# EAGLE design espurna-h (EAGLE 8.3.2)
PROJECT_AUTHOR: tinkerman.cat <xose.perez@gmail.com>; PROJECT_LICENSE: CC-BY-SA 4.0; PROJECT_NAME: ESPURNA-H; PROJECT_VERSION: 0.8.20171028
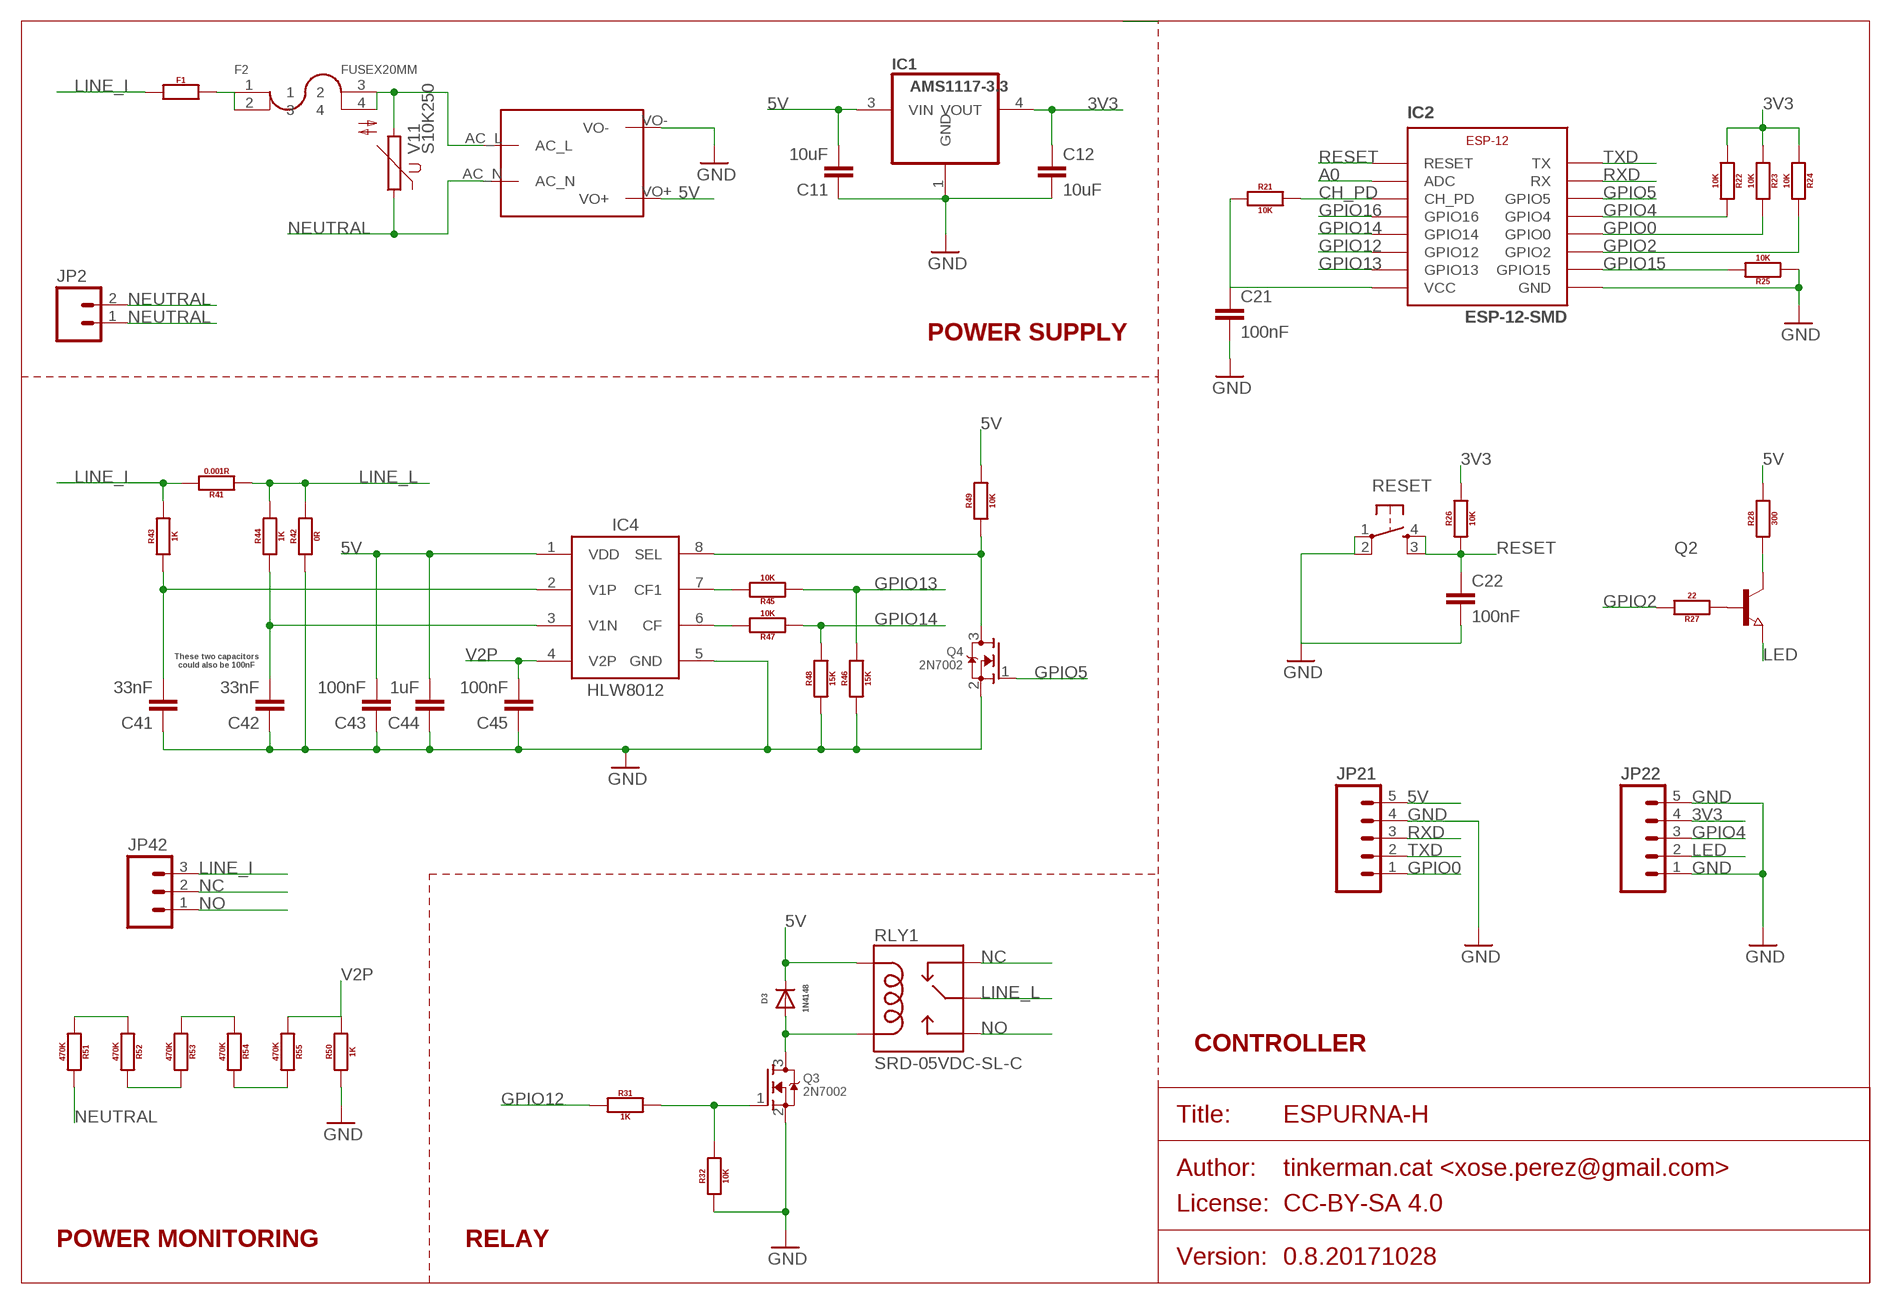
[diagram p0: schematic, sheet 1]

## Parts
C11  10uF  C-EU0805  [0805]
C12  10uF  C-EU0805  [0805]
C21  100nF  C-EU0805  [0805]
C22  100nF  C-EU0805  [0805]
C41  33nF  C-EU0805  [0805]
C42  33nF  C-EU0805  [0805]
C43  100nF  C-EU0805  [0805]
C44  1uF  C-EU0805  [0805]
C45  100nF  C-EU0805  [0805]
D3  1N4148  DIODE  [SOD80]
F1  THERMALFUSE0.4  [AXIAL-0.4]
F2  FUSEX20MM  [FUSE_5MM]
IC1  AMS1117-3.3  REG1117SOT223-2  [SOT223]
IC2  ESP-12-SMD  [ESP-12-SMD]
IC4  HLW8012  [SOP8]
JP2  M02200MIL  [SCREWTERMINAL-200MIL-2]
JP21  M05PTH  [1X05]
JP22  M05PTH  [1X05]
JP42  M03200MIL  [SCREWTERMINAL-200MIL-3]
Q2  NPN-TRANSISTOR_SOT23  [SOT23]
Q3  2N7002  MOSFET-NREFLOW  [SOT23]
Q4  2N7002  MOSFET-NREFLOW  [SOT23]
R21  10K  RESISTOR0805  [0805]
R22  10K  RESISTOR0805  [0805]
R23  10K  RESISTOR0805  [0805]
R24  10K  RESISTOR0805  [0805]
R25  10K  RESISTOR0805  [0805]
R26  10K  RESISTOR0805  [0805]
R27  22  RESISTOR0805  [0805]
R28  300  RESISTOR0805  [0805]
R31  1K  RESISTOR0805  [0805]
R32  10K  RESISTOR0805  [0805]
R41  0.001R  RESISTOR2512  [2512]
R42  0R  RESISTOR1206  [1206]
R43  1K  RESISTOR0805  [0805]
R44  1K  RESISTOR0805  [0805]
R45  10K  RESISTOR0805  [0805]
R46  15K  RESISTOR0805  [0805]
R47  10K  RESISTOR0805  [0805]
R48  15K  RESISTOR0805  [0805]
R49  10K  RESISTOR0805  [0805]
R50  1K  RESISTOR0805  [0805]
R51  470K  RESISTOR0805  [0805]
R52  470K  RESISTOR0805  [0805]
R53  470K  RESISTOR0805  [0805]
R54  470K  RESISTOR0805  [0805]
R55  470K  RESISTOR0805  [0805]
RESET  TACTILE_BUTTON_SMD  [TACTILE-BUTTON-SMD]
RLY1  SRD-05VDC-SL-C  RELAYSONGLE  [SRD-5VDC-SL-C]
U$1  MAINS_CONVERTERS  [HLK-PM01]
V11  S10K250  [S10K250]

## Nets
3V3: C12.1 C21.1 IC1.4(VOUT) IC2.VCC JP22.4 R21.1 R22.1 R23.1 R24.1 R26.2
5V: C11.2 C43.2 C44.2 D3.2(C) IC1.3(VIN) IC4.1(VDD) JP21.5 R28.2 R49.2 RLY1.COIL1 U$1.VO+
A0: IC2.ADC
CH_PD: IC2.CH_PD R21.2
GND: C11.1 C12.2 C21.2 C22.2 C41.1 C42.1 C43.1 C44.1 C45.1 IC1.1(GND) IC2.GND IC4.5(GND) JP21.4 JP22.1 JP22.5 Q3.2(S) Q4.2(S) R25.1 R32.1 R42.1 R46.1 R48.1 R50.1 RESET.1(SWA1) RESET.2(SWB1) U$1.VO-
GPIO0: IC2.GPIO0 JP21.1 R23.2
GPIO2: IC2.GPIO2 R24.2 R27.2
GPIO4: IC2.GPIO4 JP22.3 R22.2
GPIO5: IC2.GPIO5 Q4.1(G)
GPIO12: IC2.GPIO12 R31.1
GPIO13: IC2.GPIO13 R45.1 R46.2
GPIO14: IC2.GPIO14 R47.1 R48.2
GPIO15: IC2.GPIO15 R25.2
GPIO16: IC2.GPIO16
LED: JP22.2 Q2.2(E)
LINE_I: F1.P$1 JP42.3 R41.2 R43.2
LINE_L: R41.1 R42.2 R44.2 RLY1.COMMON(MAIN)
LINE_P: F2.3 F2.4 U$1.AC_L V11.2
N$1: Q2.3(C) R28.1
N$3: Q2.1(B) R27.1
N$4: D3.1(A) Q3.3(D) RLY1.COIL2
N$5: Q3.1(G) R31.2 R32.2
N$6: R51.1 R52.1
N$7: F1.P$2 F2.1 F2.2
N$8: R52.2 R53.2
N$10: IC4.8(SEL) Q4.3(D) R49.1
N$11: IC4.7(CF1) R45.2
N$12: C41.2 IC4.2(V1P) R43.1
N$13: IC4.6(CF) R47.2
N$14: C42.2 IC4.3(V1N) R44.1
N$15: R53.1 R54.1
N$16: R54.2 R55.2
NC: JP42.2 RLY1.CLOSED(NC)
NEUTRAL: JP2.1 JP2.2 R51.2 U$1.AC_N V11.1
NO: JP42.1 RLY1.OPEN(NO)
RESET: C22.1 IC2.RESET R26.1 RESET.3(SWB2) RESET.4(SWA2)
RXD: IC2.RX JP21.3
TXD: IC2.TX JP21.2
V2P: C45.2 IC4.4(V2P) R50.2 R55.1

## Notes on the sheet
- POWER SUPPLY
- These two capacitors
  could also be 100nF
- CONTROLLER
- POWER MONITORING | RELAY

## Library data of the parts
C11 C12 C21 C22 C41-C45 = xose:C-EU: CAPACITOR, European symbol
D3 = xose:DIODE
F1 = xose:THERMALFUSE
F2 = xose:FUSE
IC1 = xose:REG1117: 800mA and 1A Low Dropout (LDO) Positive Regulator 1.8V, 2.5V, 2.85V, 3.3V, 5V, and Adj
IC2 = xose:ESP-12
IC4 = xose:HLW8012
JP2 = xose:M02: Standard 2-pin 0.1" header. Use with - straight break away headers ( PRT-00116) - right angle break away headers (PRT-00553) - swiss pins (PRT-00743) - machine pins (PRT-00117) - female headers (PRT-00115) Molex polarized connector foot print use with: PRT-08233 with associated crimp pins and housings. 2.54_SCREWTERM for use with PRT-10571. 3.5mm Screw Terminal footprints for PRT-08084 5mm Screw Terminal footprints for use with PRT-08432
JP21 JP22 = xose:M05: Header 5 Standard 5-pin 0.1" header. Use with straight break away headers (SKU : PRT-00116), right angle break away headers (PRT-00553), swiss pins (PRT-00743), machine pins (PRT-00117), and female headers (PRT-00115). Molex polarized connector foot print use with SKU : PRT-08230 with associated crimp pins and housings.
JP42 = xose:M03: Header 3 Standard 3-pin 0.1" header. Use with straight break away headers (SKU : PRT-00116), right angle break away headers (PRT-00553), swiss pins (PRT-00743), machine pins (PRT-00117), and female headers (PRT-00115). Molex polarized connector foot print use with SKU : PRT-08232 with associated crimp pins and housings.
Q2 = xose:NPN-TRANSISTOR_: NPN TRANSISTOR
Q3 Q4 = xose:MOSFET-N: N-Channel Mosfet 2N7002E - 60V 260mA SOT23 [Digikey: 2N7002ET1GOSTR-ND] - REEL BSH103 - 30V 850mA SOT23 [Digikey: 568-5013-1-ND]
R21-R28 R31 R32 R41-R55 = xose:RESISTOR: Generic EU resistor symbol
RESET = xose:TACTILE_BUTTON: Tactile Button SparkFun Electronics' Tactile Button COM-10302
RLY1 = Spark:RELAY: SPDT relay (COM-00101)
U$1 = captain-slow:MAINS_CONVERTERS
V11 = xose:S10K250: VARISTOR

## Board
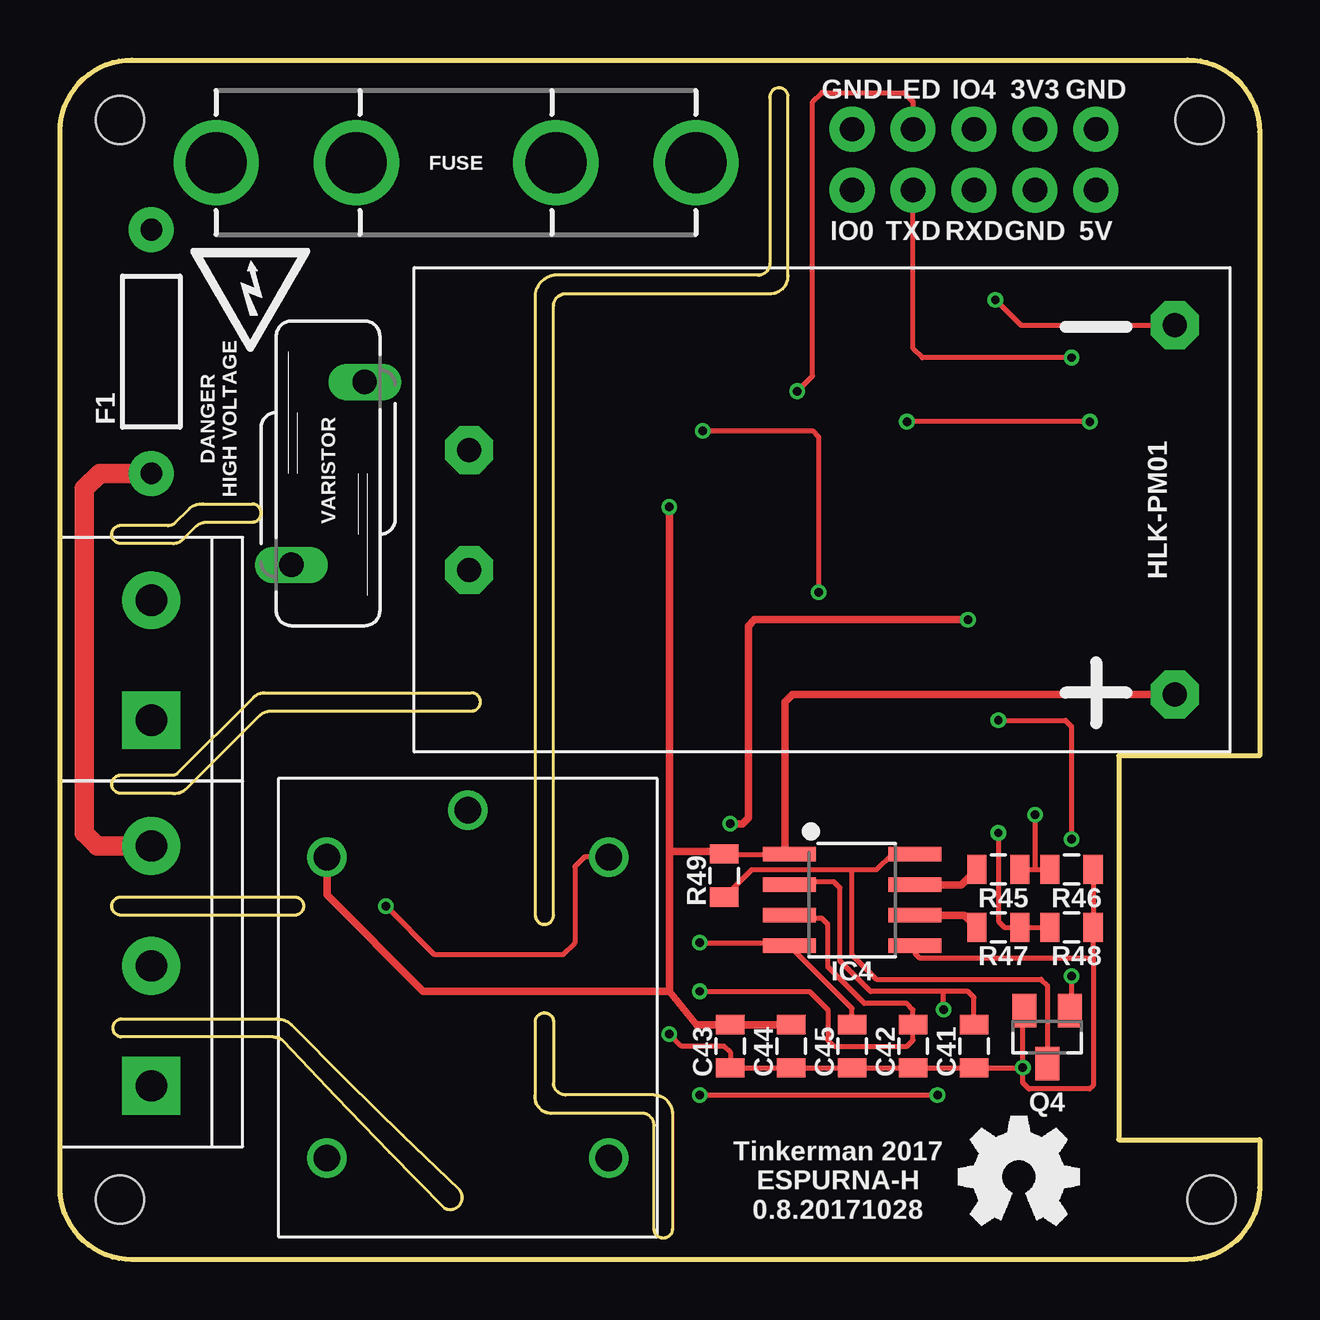
[diagram p1: board, top side]
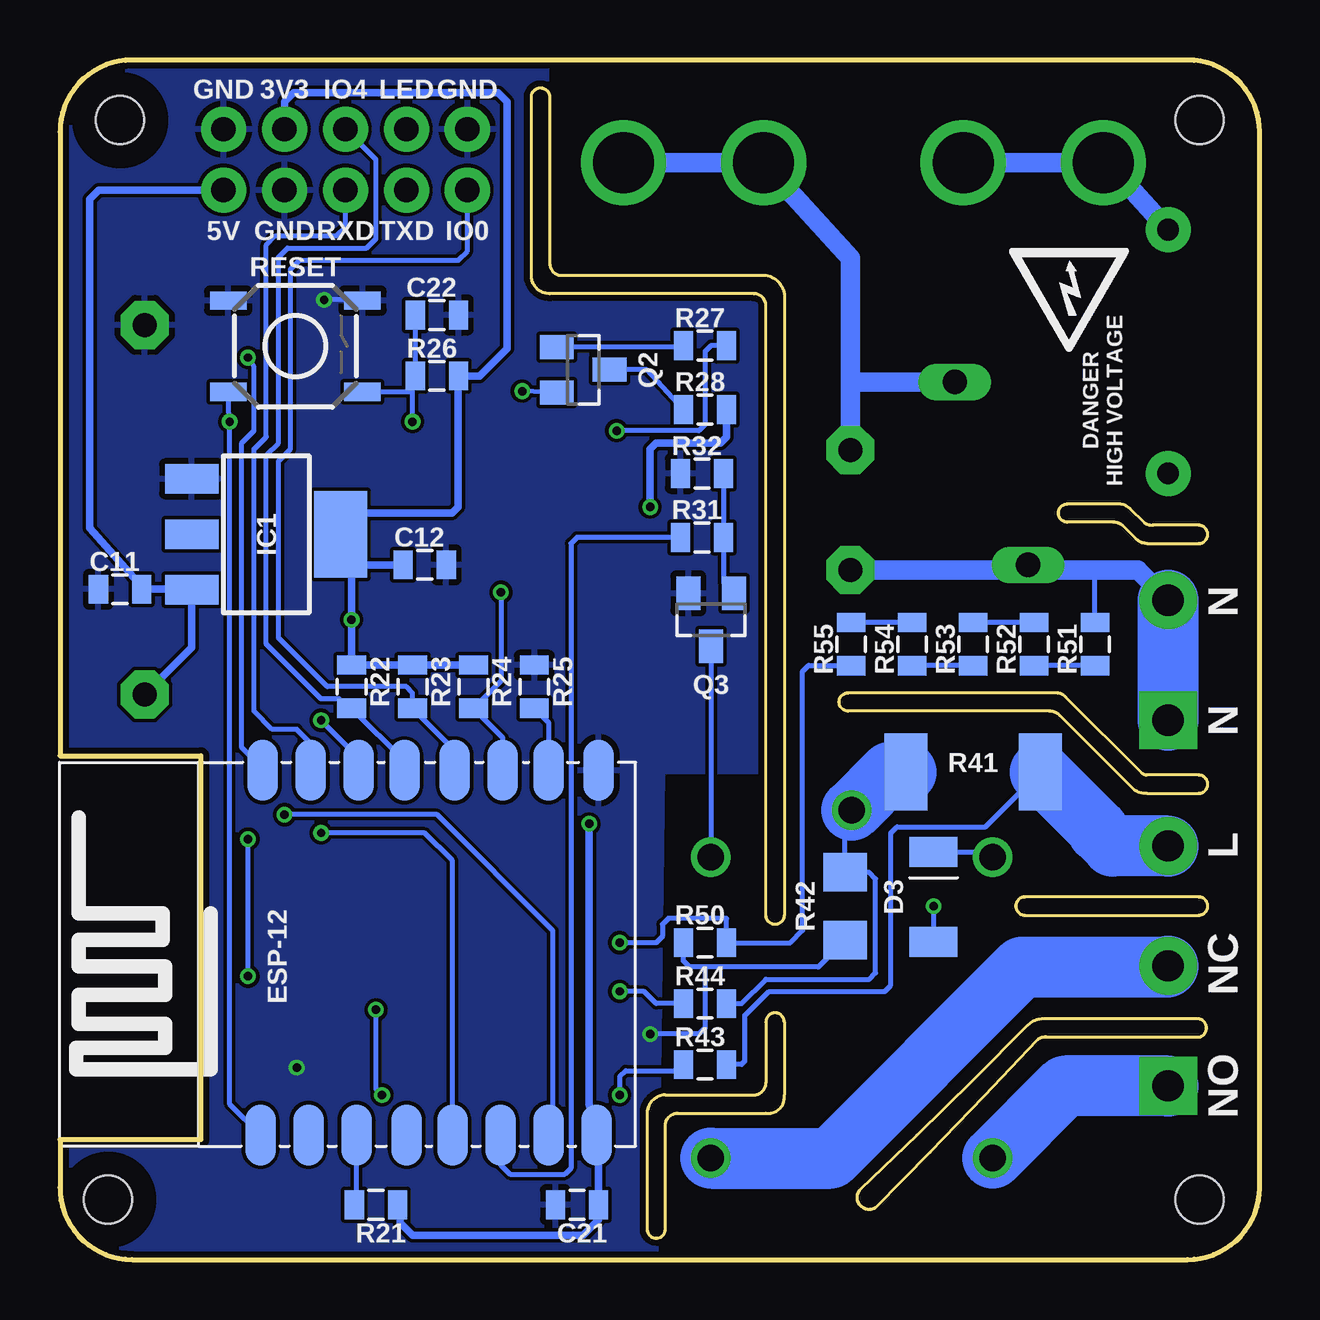
[diagram p2: board, bottom side, seen from below]

Size 50 x 50 mm. Coordinates in mm from the lower left corner, seen from the top.
Outline: 0,3 0,47 arc-90 3,50 47,50 arc-90 50,47 50,21 44.13,21 44.13,5 50,5 50,3 arc-90 47,0 3,0 arc-90 0,3
Outline: 19.81,14.35 arc180 20.57,14.35 20.57,39.75 arc-90 21.08,40.26 29.59,40.26 arc90 30.35,41.02 30.35,48.51 arc180 29.59,48.39 29.59,41.53 arc-90 29.08,41.02 20.57,41.02 arc74 19.81,40.26 19.81,14.35
Outline: 19.81,9.91 arc-180 20.57,9.91 20.57,7.37 arc90 21.08,6.86 24.77,6.86 arc-90 25.53,6.1 25.53,1.27 arc-180 24.77,1.27 24.77,5.59 arc90 24.26,6.1 20.57,6.1 arc-106 19.81,6.86 19.81,9.91
Outline: 8.89,9.27 arc-46 9.27,9.14 arc2 16,2.16 arc164 16.64,2.92 arc-2 9.65,9.78 arc44 9.02,10.03 2.54,10.03 arc164 2.54,9.27 8.89,9.27
Outline: 2.54,15.11 9.78,15.11 arc-90 10.16,14.73 arc-90 9.78,14.35 2.54,14.35 arc-90 2.16,14.73 arc-90 2.54,15.11
Outline: 2.54,20.19 4.7,20.19 arc45 4.92,20.28 8.07,23.44 arc-45 8.52,23.62 17.14,23.62 arc-90 17.53,23.24 arc-90 17.14,22.86 8.77,22.86 arc45 8.32,22.67 5.27,19.62 arc-45 4.69,19.43 2.54,19.43 arc-90 2.16,19.81 arc-90 2.54,20.19
Outline: 2.54,30.61 4.45,30.61 arc45 4.79,30.7 5.4,31.31 arc-45 5.98,31.5 8,31.5 arc-90 8.38,31.11 arc-90 8,30.73 6.11,30.73 arc45 5.66,30.55 5.14,30.03 arc-45 4.69,29.84 2.54,29.84 arc-90 2.16,30.23 arc-90 2.54,30.61
Copper layers (1*16): Top 0.035mm / dielectric 1.5mm / Bottom 0.035mm
Design rules "seedstudio-2layer": minimum track width 6mil, minimum drill 12mil, track to track 6mil, track to pad 6mil, pad to pad 6mil, via to via 6mil, smd to smd 0mil, copper to edge 10mil, drill to drill 10mil, minimum pad ring 10mil, minimum via ring 6mil, stop-mask expansion 2mil, vias tented up to drill 100mil, thermal gap 10mil

### Footprints (pad centres in the part's own frame; a part is rotated, then mirrored left to right if it is on the bottom)
0805 = smd 0.8 x 1.2: 1 -0.9,0; 2 0.9,0
SOD80 = smd 1.25 x 2: 1 -1.872,0; 2 1.872,0
AXIAL-0.4 = drill 0.9 pad 1.88: P$1 -5.08,0; P$2 5.08,0
FUSE_5MM = drill 2.54 pad 3.556: 1 0,-10; 2 0,-4.158; 3 0,4.158; 4 0,10
SOT223 = smd 1.219 x 2.235: 1 -2.311,-3.099; 2 0,-3.099; 3 2.311,-3.099 | smd 3.6 x 2.2: 4 0,3.099
ESP-12-SMD = smd 2.54 x 1.27: ADC -7,5.1; CH_PD -7,3.1; GND 8.2,-7; GPIO0 8.2,-1; GPIO2 8.2,-3; GPIO4 8.2,1.1; GPIO5 8.2,3; GPIO12 -7,-2.9; GPIO13 -7,-4.9; GPIO14 -7,-0.9; GPIO15 8.2,-4.9; GPIO16 -7,1; RESET -7,7.1; RX 8.2,5; TX 8.2,7; VCC -7,-6.9
SOP8 = smd 0.61 x 2.21: 1 0.381,-0.838; 2 1.651,-0.838; 3 2.921,-0.838; 4 4.191,-0.838; 5 4.191,4.394; 6 2.921,4.394; 7 1.651,4.394; 8 0.381,4.394
SCREWTERMINAL-200MIL-2 = drill 1.3 pad 2.413 square: 1 0,0 | drill 1.3 pad 2.413: 2 5,0
1X05 = drill 1.016 pad 1.88: 1 0,0; 2 2.54,0; 3 5.08,0; 4 7.62,0; 5 10.16,0
SCREWTERMINAL-200MIL-3 = drill 1.3 pad 2.413 square: 1 0,0 | drill 1.3 pad 2.413: 2 5,0; 3 10,0
SOT23 = smd 1 x 1.4: 1 -0.95,-1.1; 2 0.95,-1.1; 3 0,1.1
2512 = smd 1.8 x 3.2: 1 -2.8,0; 2 2.8,0
1206 = smd 1.6 x 1.803: 1 -1.422,0; 2 1.422,0
TACTILE-BUTTON-SMD = smd 1.524 x 0.762: 1 -2.794,1.905; 2 2.794,1.905; 3 -2.794,-1.905; 4 2.794,-1.905
SRD-5VDC-SL-C = drill 1.1: CLOSED -6.275,-5.875; COIL1 6.275,5.875; COIL2 6.275,-5.875; COMMON 8.225,0; OPEN -6.275,5.875
HLK-PM01 = drill 1 pad 2 octagon: AC_L -14.7,2.5; AC_N -14.7,-2.5; VO+ 14.7,-7.7; VO- 14.7,7.7
HOLE_M2_WIDE = hole 2: 0,0
S10K250 = drill 1.016 long: 1 -1.524,-3.81; 2 1.524,3.81

### Placement (x,y rotation side)
C11  47.5,27.94 0 bottom
C12  34.8,28.96 0 bottom
C21  28.45,2.29 180 bottom
C22  34.29,39.37 0 bottom
C41  38.1,8.89 90 top
C42  35.56,8.89 90 top
C43  27.94,8.89 90 top
C44  30.48,8.89 90 top
C45  33.02,8.89 90 top
D3  13.59,15.11 90 bottom
F1  3.81,37.85 90 top
F2  16.51,45.72 270 top
IC1  41.4,30.23 270 bottom
IC2  34.54,12.19 90 bottom
IC4  31.24,17.27 270 top
JP2  3.81,22.48 90 top
JP21  33.02,44.58 0 top
JP22  33.02,47.12 0 top
JP42  3.81,7.24 90 top
Q2  28.19,37.08 270 bottom
Q3  22.86,26.67 180 bottom
Q4  41.15,9.27 180 top
R21  36.83,2.29 180 bottom
R22  37.85,23.88 270 bottom
R23  35.31,23.88 270 bottom
R24  32.77,23.88 270 bottom
R25  30.23,23.88 270 bottom
R26  34.29,36.83 0 bottom
R27  23.11,38.1 0 bottom
R28  23.11,35.43 0 bottom
R31  23.24,30.1 0 bottom
R32  23.24,32.77 0 bottom
R41  11.94,20.32 0 bottom
R42  17.27,14.73 90 bottom
R43  23.11,8.13 0 bottom
R44  23.11,10.67 0 bottom
R45  39.12,16.26 180 top
R46  42.16,16.26 180 top
R47  39.12,13.84 180 top
R48  42.16,13.84 180 top
R49  27.69,16 90 top
R50  23.11,13.21 0 bottom
R51  6.86,25.65 90 bottom
R52  9.4,25.65 90 bottom
R53  11.94,25.65 90 bottom
R54  14.48,25.65 90 bottom
R55  17.02,25.65 90 bottom
RESET  40.19,38.07 0 bottom
RLY1  17,10.5 90 top
U$1  31.76,31.25 0 top
U$2  [HOLE_M2_WIDE]  2.5,2.5 0 top
U$3  [HOLE_M2_WIDE]  2.5,47.5 0 top
U$4  [HOLE_M2_WIDE]  47.5,47.5 0 top
U$5  [HOLE_M2_WIDE]  48,2.5 0 top
V11  11.18,32.77 0 top

### Tracks (layer width: path | path; a pad name or v marks a point on that pad's centre or on a via)
3V3  (via drill 0.35)
  Top 0.305: v27.94,18.16 28.45,18.16 28.7,18.41 28.7,26.42 28.96,26.67 v37.85,26.67
  Bottom 0.203: 33.53,37.2 R26.2 33.39,37.07
  Bottom 0.305: R21.1 35.81,2.17 35.81,1.52 35.31,1.02 28.19,1.02 27.55,1.66 C21.1 27.55,5.1 IC2.VCC 27.94,6.5 v27.94,18.16 | R24.1 R23.1 R22.1 v37.85,26.67 37.85,28.96 | 38.36,30.77 38.76,31.5 | 38.36,30.77 IC1.4 37.85,29.31 37.85,28.96 | C12.1 37.85,28.96 | JP22.4 40.64,48.26 40.26,48.64 31.75,48.64 31.37,48.26 31.37,37.97 32.51,36.83 R26.2 33.4,36.82 33.4,31.37 33.66,31.11 37.85,31.11 38.19,30.77 38.36,30.77
5V  (via drill 0.35)
  Top 0.203: 27.57,17.02 R49.2 IC4.1
  Top 0.305: 25.4,11.18 15.14,11.18 11.12,15.19 RLY1.COIL1 | 25.4,11.18 25.4,17.02 | 25.4,17.02 27.57,17.02 | C44.2 C43.2 26.53,9.79 25.4,11.18 | v25.4,31.37 25.4,17.02 | IC4.1 30.23,17.07 30.23,23.24 30.54,23.55 U$1.VO+
  Bottom 0.203: 22.29,35.48 22.23,35.55 | D3.2 11.34,16.98 RLY1.COIL1
  Bottom 0.305: JP21.5 48.39,44.58 48.77,44.2 48.77,30.48 46.6,28.06 C11.2 44.32,27.94 IC1.3 44.5,25.51 U$1.VO+ | R28.2 22.23,35.55 22.23,34.29 22.48,34.04 25.15,34.04 25.4,33.78 v25.4,31.37
CH_PD
  Bottom 0.203: R21.2 37.64,2.37 IC2.CH_PD
GND  (via drill 0.35)
  Top 0.203: 43.06,13.62 R48.1 | v25.4,9.4 25.91,8.89 27.69,8.89 27.94,8.64 C43.1 C44.1 C45.1 C42.1 C41.1 v40.12,7.99 v40.13,8 | v40.13,8 40.13,7.37 40.39,7.11 42.93,7.11 43.06,7.25 43.06,12.57 | R46.1 R48.1 | 43.06,12.57 R48.1 | IC4.5 35.64,12.75 35.81,12.57 43.06,12.57 | Q4.2 40.13,10.3 v40.13,8 | v38.99,40.01 40.04,38.95 U$1.VO-
  Bottom 0.203: 23.11,12.19 18.39,12.19 R42.1 | 23.11,12.19 23.76,12.19 24.01,12.45 R50.1 | 23.11,12.19 23.11,9.65 23.37,9.4 v25.4,9.4 | RESET.2 37.43,40.01 v38.99,40.01
  pour Bottom: 29.72,50.29 29.72,40.64 20.45,40.64 20.19,20.32 24.89,20.32 25.15,-0.25 50.8,-0.25 50.8,50.29
GPIO0
  Bottom 0.203: IC2.GPIO0 33.54,21.21 R23.2 35.31,23.62 35.56,23.88 38.86,23.88 40.89,25.91 40.89,33.27 40.39,33.78 40.39,41.27 40.01,41.66 33.4,41.66 33.02,42.04 JP21.1
GPIO2  (via drill 0.35)
  Top 0.203: v26.8,34.54 31.37,34.54 31.62,34.29 v31.62,27.81
  Bottom 0.203: IC2.GPIO2 31.54,21.75 R24.2 31.62,24.12 v31.62,27.81 | R27.2 22.86,38.1 23.11,37.85 23.11,34.8 23.37,34.54 v26.8,34.54
GPIO4
  Bottom 0.203: IC2.GPIO4 35.64,20.77 R22.2 37.96,22.98 38.35,23.37 39.12,23.37 41.4,25.65 41.4,33.53 40.89,34.04 40.89,41.78 40.51,42.16 37.21,42.16 36.83,42.55 36.83,45.85 JP22.3
GPIO5  (via drill 0.35)
  Top 0.203: v39.12,22.48 41.91,22.48 42.16,22.23 v42.16,17.53 | v42.16,11.81 42.16,10.44 Q4.1
  Bottom 0.203: v42.16,11.81 v42.16,17.53 | IC2.GPIO5 37.54,20.91 v39.12,22.48
GPIO12
  Bottom 0.203: IC2.GPIO12 31.64,3.96 31.24,3.56 28.96,3.56 28.7,3.81 28.7,29.84 28.45,30.1 R31.1
GPIO13  (via drill 0.35)
  Top 0.203: R45.1 40.64,16.26 | 40.64,16.26 R46.2 | v40.64,18.54 40.64,16.26
  Bottom 0.203: v40.64,18.54 34.29,18.54 29.46,13.72 29.46,5.37 IC2.GPIO13
GPIO14  (via drill 0.35)
  Top 0.203: v39.12,17.78 39.12,14.1 39.37,13.84 R47.1 R48.2
  Bottom 0.203: IC2.GPIO14 33.64,16.63 34.8,17.78 v39.12,17.78
GPIO15
  Bottom 0.203: R25.2 29.64,22.39 IC2.GPIO15
LED  (via drill 0.35)
  Top 0.203: v30.73,36.2 31.37,36.83 31.37,48.26 31.75,48.64 35.18,48.64 35.56,48.26 JP22.2
  Bottom 0.203: Q2.2 v30.73,36.2
LINE_I
  Top 0.813: JP42.3 1.56,17.24 1.02,17.78 1.02,32.13 1.65,32.77 F1.P$1
  Bottom 0.203: R43.2 21.59,8.13 21.46,8.26 21.46,10.16 20.45,11.18 15.62,11.18 15.37,11.43 15.37,17.78 15.11,18.03 11.42,18.03 R41.2
  Bottom 2.54: R41.2 6.73,17.91 6.73,17.84 6.12,17.24 JP42.3
LINE_L
  Bottom 0.203: R44.2 21.59,10.67 20.57,11.68 16.26,11.68 16,11.94 16,15.88 16.26,16.13 17.25,16.13 R42.2 17.27,18.45 RLY1.COMMON
  Bottom 2.54: RLY1.COMMON 15.4,20.32 R41.1
LINE_P
  Bottom 0.813: 17.06,36.7 U$1.AC_L | 17.06,36.7 17.06,41.73 F2.3 F2.4 | V11.2 16.93,36.58 17.06,36.7
N$1
  Bottom 0.203: R28.1 25.54,37.08 Q2.3
N$3
  Bottom 0.203: R27.1 24.08,38.03 Q2.1
N$4  (via drill 0.35)
  Top 0.203: RLY1.COIL2 21.86,16.77 21.46,16.38 21.46,13.21 20.95,12.7 15.62,12.7 v13.59,14.73
  Bottom 0.203: v13.59,14.73 D3.1 | Q3.3 22.88,25.55 RLY1.COIL2
N$5
  Bottom 0.203: R32.2 R31.2 22.34,28.2 Q3.1
N$6
  Bottom 0.203: R51.1 R52.1
N$7
  Bottom 0.813: F2.2 F2.1 6.36,45.72 arc45 6.29,45.66 F1.P$2
N$8
  Bottom 0.203: R52.2 R53.2
N$10
  Top 0.203: R49.1 28.84,16.26 33.02,16.26 | 33.02,16.26 34.04,16.26 34.67,16.89 IC4.8 | 33.02,16.26 33.02,12.7 34.04,11.68 40.89,11.68 41.15,11.43 Q4.3
N$11
  Top 0.305: R45.2 37.58,15.62 IC4.7
N$12  (via drill 0.35)
  Top 0.203: C41.2 38.1,10.92 37.85,11.18 36.83,11.18 | IC4.2 30.53,15.75 32.26,15.75 32.51,15.49 32.51,12.45 33.78,11.18 36.83,11.18 | v26.67,6.86 v36.58,6.86 | v36.83,10.41 36.83,11.18
  Bottom 0.203: v26.67,6.86 26.67,7.62 26.42,7.87 24.38,7.87 24.13,8.13 R43.1 | v36.58,6.86 36.83,7.11 v36.83,10.41
N$13
  Top 0.305: IC4.6 37.71,14.35 R47.2
N$14  (via drill 0.35)
  Top 0.203: v26.67,11.18 31.24,11.18 32,10.41 32,9.14 32.26,8.89 35.31,8.89 35.56,9.14 C42.2 35.56,10.41 35.31,10.67 33.53,10.67 32,12.19 32,13.97 31.75,14.22 30.53,14.22 IC4.3 30.86,14.35
  Bottom 0.203: R44.1 25.15,10.67 25.65,11.18 v26.67,11.18
N$15
  Bottom 0.203: R53.1 R54.1
N$16
  Bottom 0.203: R54.2 R55.2
NC
  Bottom 2.54: RLY1.CLOSED 17.87,4.22 9.91,12.19 3.86,12.19 JP42.2
NEUTRAL
  Bottom 0.203: R51.2 6.86,28.75
  Bottom 0.813: 9.86,28.75 U$1.AC_N | 9.86,28.75 V11.1 | JP2.2 5.08,28.75 6.86,28.75 9.86,28.75
  Bottom 2.54: JP2.1 JP2.2
NO
  Bottom 2.54: JP42.1 8.11,7.24 RLY1.OPEN
RESET  (via drill 0.35)
  Top 0.203: v42.93,34.92 v35.31,34.92
  Bottom 0.203: C22.1 R26.1 | R26.1 35.35,36.16 RESET.4 | IC2.RESET 42.93,6.47 v42.93,34.92 42.98,35.36 RESET.3 | v35.31,34.92 35.31,37.22 R26.1
RXD
  Bottom 0.203: IC2.RX 39.54,21.51 40.13,22.1 41.15,22.1 41.91,22.86 41.91,33.78 41.4,34.29 41.4,42.29 41.02,42.67 38.48,42.67 38.1,43.05 JP21.3
TXD  (via drill 0.35)
  Top 0.203: v42.16,37.59 35.94,37.59 35.56,37.97 JP21.2
  Bottom 0.203: IC2.TX 41.54,20.46 42.42,21.34 42.42,34.04 41.91,34.54 41.91,37.21 v42.16,37.59
V2P  (via drill 0.35)
  Top 0.203: C45.2 33.02,10.46 IC4.4 30.28,13.21 v26.67,13.21
  Bottom 0.203: 22.1,13.32 R50.2 | v26.67,13.21 25.15,13.21 24.89,13.46 24.89,13.97 24.64,14.22 22.23,14.22 22.21,14.21 R50.2 | 21.96,12.95 R50.2 | R50.2 19.56,13.21 19.05,13.72 19.05,24.51 18.8,24.77 17.03,24.77 R55.1

### Text on the board
tPlace: GND | LED | IO4 | 3V3 | GND | IO0 | TXD | RXD | GND | 5V
bPlace: GND | LED | IO4 | 3V3 | GND | IO0 | TXD | RXD | GND | 5V | N | N | L | NC | NO
tNames: FUSE | DANGER / HIGH VOLTAGE | VARISTOR | Tinkerman 2017 / ESPURNA-H / 0.8.20171028
bNames: DANGER / HIGH VOLTAGE